# Altium schematic sheet CPU.SchDoc
size A4
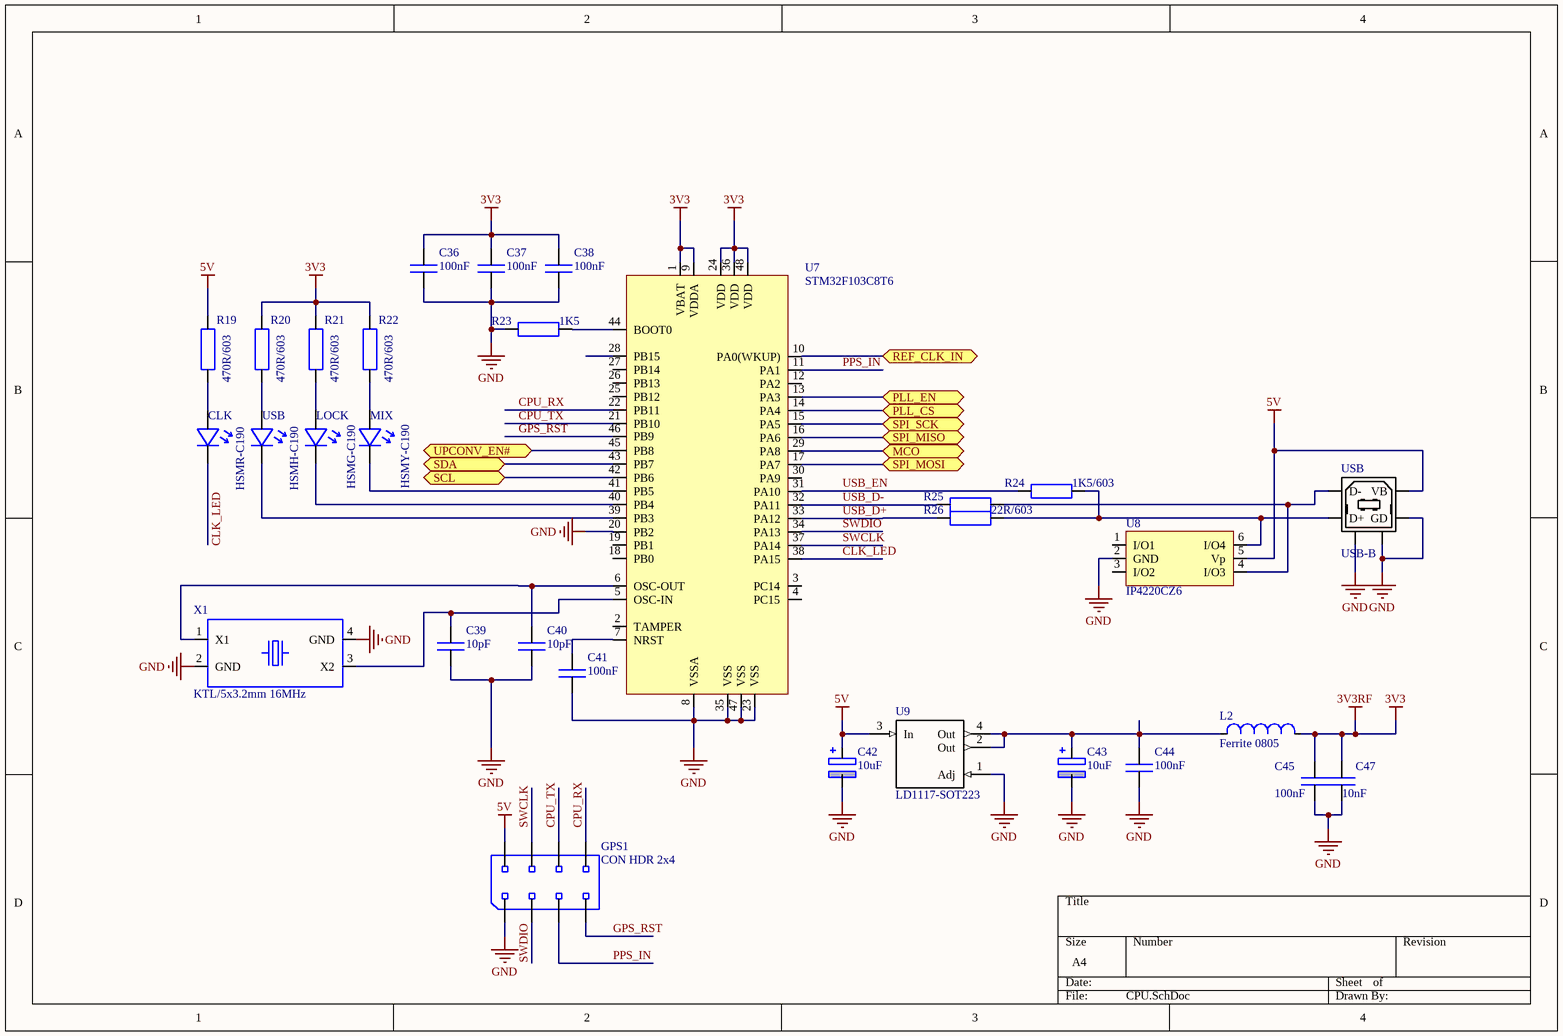
[diagram p0: CPU.SchDoc]

## Parts
(Parts that share a designator on the sheet are numbered #1, #2 ... from top to bottom, then left to right.)
C36  100nF  [smd C0603_0.80]
C37  100nF  [smd C0603_0.80]
C38  100nF  [smd C0603_0.80]
C39  10pF  [smd C0603_0.80]
C40  10pF  [smd C0603_0.80]
C41  100nF  [smd C0603_0.80]
C42  10uF  [smd C1206 polar]
C43  10uF  [smd C1206 polar]
C44  100nF  [smd C0603_0.80]
C45  100nF  [smd C0603_0.80]
C47  10nF  [smd C0603_0.80]
CLK  HSMR-C190  [led HSMH-C190 (Avago Technologies)]
GPS1  CON HDR 2x4  [hdr 2x4]
L2  Ferrite 0805  [smd C0805]
LOCK  HSMG-C190  [led HSMH-C190 (Avago Technologies)]
MIX  HSMY-C190  [led HSMH-C190 (Avago Technologies)]
R19  470R/603  [smd C0603_0.45]
R20  470R/603  [smd C0603_0.45]
R21  470R/603  [smd C0603_0.45]
R22  470R/603  [smd C0603_0.45]
R23  1K5  [smd C0603_0.45]
R24  1K5/603  [smd C0603_0.45]
R25  22R/603  [smd C0603_0.45]  (value not drawn)
R26  22R/603  [smd C0603_0.45]
U7  STM32F103C8T6  [TSQFP50P900X900X160-48N]
U8  IP4220CZ6  [smd SOT-457]
U9  LD1117-SOT223  [SOT223]
USB#1  HSMH-C190  [led HSMH-C190 (Avago Technologies)]
USB#2  USB-B  [USB-B]
X1  KTL/5x3.2mm 16MHz  [smd KTL 5x3.2]

## Ports
MCO, PLL_CS, PLL_EN, REF_CLK_IN, SCL, SDA, SPI_MISO, SPI_MOSI, SPI_SCK, UPCONV_EN#

## Nets
3V3: C36.2 C37.2 C38.2 C45.2 C47.2 L2.2 R20.2 R21.2 R22.2 U7.1(VBAT) U7.9(VDDA) U7.24(VDD) U7.36(VDD) U7.48(VDD)  [also labelled 3V3RF]
5V: C42.1 GPS1.2 R19.2 U8.5(Vp) U9.3(In) USB#2.1(VB)
GND: C36.1 C37.1 C38.1 C39.1 C40.1 C41.1 C42.2 C43.2 C44.1 C45.1 C47.1 GPS1.1 R23.1 U7.8(VSSA) U7.20(PB2) U7.23(VSS) U7.35(VSS) U7.47(VSS) U8.2(GND) U9.1(Adj) USB#2.4(GD) USB#2.5 USB#2.6 X1.2(GND) X1.4(GND)
CLK_LED: CLK.2 U7.38(PA15)
CPU_RX: GPS1.8 U7.22(PB11)
CPU_TX: GPS1.6 U7.21(PB10)
GPS_RST: GPS1.7 U7.46(PB9)
MCO: U7.29(PA8) ; port MCO
PLL_CS: U7.14(PA4) ; port PLL_CS
PLL_EN: U7.13(PA3) ; port PLL_EN
PPS_IN: GPS1.5 U7.11(PA1)
REF_CLK_IN: U7.10(PA0(WKUP)) ; port REF_CLK_IN
SCL: U7.42(PB6) ; port SCL
SDA: U7.43(PB7) ; port SDA
SPI_MISO: U7.16(PA6) ; port SPI_MISO
SPI_MOSI: U7.17(PA7) ; port SPI_MOSI
SPI_SCK: U7.15(PA5) ; port SPI_SCK
SWCLK: GPS1.4 U7.37(PA14)
SWDIO: GPS1.3 U7.34(PA13)
UPCONV_EN#: U7.45(PB8) ; port UPCONV_EN#
USB_D+: R26.1 U7.33(PA12)
USB_D-: R25.1 U7.32(PA11)
USB_EN: R24.1 U7.31(PA10)
NetC39_2: C39.2 U7.5(OSC-IN) X1.3(X2)
NetC40_2: C40.2 U7.6(OSC-OUT) X1.1(X1)
NetC41_2: C41.2 U7.7(NRST)
NetC43_1: C43.1 C44.2 L2.1 U9.2(Out) U9.4(Out)
NetCLK_1: CLK.1 R19.1
NetLOCK_1: LOCK.1 R21.1
NetLOCK_2: LOCK.2 U7.40(PB4)
NetMIX_1: MIX.1 R22.1
NetMIX_2: MIX.2 U7.41(PB5)
NetR20_1: R20.1 USB#1.1
NetR23_2: R23.2 U7.44(BOOT0)
NetR24_2: R24.2 R26.2 U8.6(I/O4) USB#2.3(D+)
NetR25_2: R25.2 U8.4(I/O3) USB#2.2(D-)
NetU7_39: U7.39(PB3) USB#1.2

Not connected (* = marked no-connect by the designer): U7 2(TAMPER) 3(PC14) 4(PC15) 12(PA2) 18(PB0) 19(PB1) 25(PB12) 26(PB13) 27(PB14) 28(PB15) 30(PA9); U8 1(I/O1) 3(I/O2)

## Library data of the parts
C36-C38 C41 C44 C45 C47 = CSMD603/100nF: smd capaciteit, verp.0603, 100nF; Part Number: CSMD603/100nF; Component Kind: Standard; Component Type: Standard; Designator: CSMD603/100nF; Pin Count: 2; Supplier 1: Farnell
C39 C40 = CSMD603/10pF: smd capaciteit, verp.0603, 10pF; Part Number: CSMD603/10pF; Component Kind: Standard; Component Type: Standard; Designator: CSMD603/10pF; Pin Count: 2; Supplier 1: Farnell
C42 C43 = CSMD1206/10uF/10V: smd capaciteit, tantalium, verp.1206, 10uF/10V; Part Number: CSMD1206/10uF/10V; Component Kind: Standard; Component Type: Standard; Designator: CSMD1206/10uF/10V; Pin Count: 2; Supplier 1: Farnell
CLK USB#1 = HSMH-C190: led smd rood, Avago Techn., HSMH-C190; Supplier 1: Farnell
GPS1 = CON HDR 2x4: pcb header recht 2x4  pitch 100mil; Part Number: CON HDR 2x4; Component Kind: Standard; Component Type: Standard; Designator: CON HDR 2x4; Pin Count: 8; Supplier 1: Farnell
L2 = Ferrite 0805: Ferrite bead, 0805 package; Supplier 1: Farnell
LOCK = HSMG-C190: led smd groen, Avago Techn., HSMG-C190; Supplier 1: Farnell
MIX = HSMY-C190: led smd geel, Avago Techn., HSMY-C190; Supplier 1: Farnell
R19-R22 = 470R/603: weerstand SMD603, 470R; Supplier 1: Farnell
R23 R24 = 1K5/603: weerstand SMD603, 1K5; Supplier 1: Farnell
R25 R26 = 22R/603: weerstand SMD603, 22R; Supplier 1: Farnell
U7 = STM32F100xx
U8 = IP4220CZ6: Dual USB 2.0 integrated ESD protection; Supplier 1: Farnell
USB#2 = USB-B: USB B DEVICE CONNECTOR; Text Field1: Assmann; Text Field2: AU-Y1007; Text Field3: Digi-Key; Text Field4: AE1085-ND; Text Field5: Thru-Hole; Text Field6: 1.168; NI?: *; O?: *; Section:: *
X1 = KTL/5x3.2mm 16MHz: TXC Xtal 16.000 MHz, 5x3.2mm; Part Number: KTL/5x3.2mm 16MHz; Component Kind: Standard; Component Type: Standard; Designator: KTL/5x3.2mm 16MHz; Pin Count: 4; Supplier 1: Farnell